# EAGLE design AM-24bit-ADS1231 (EAGLE 6.1)
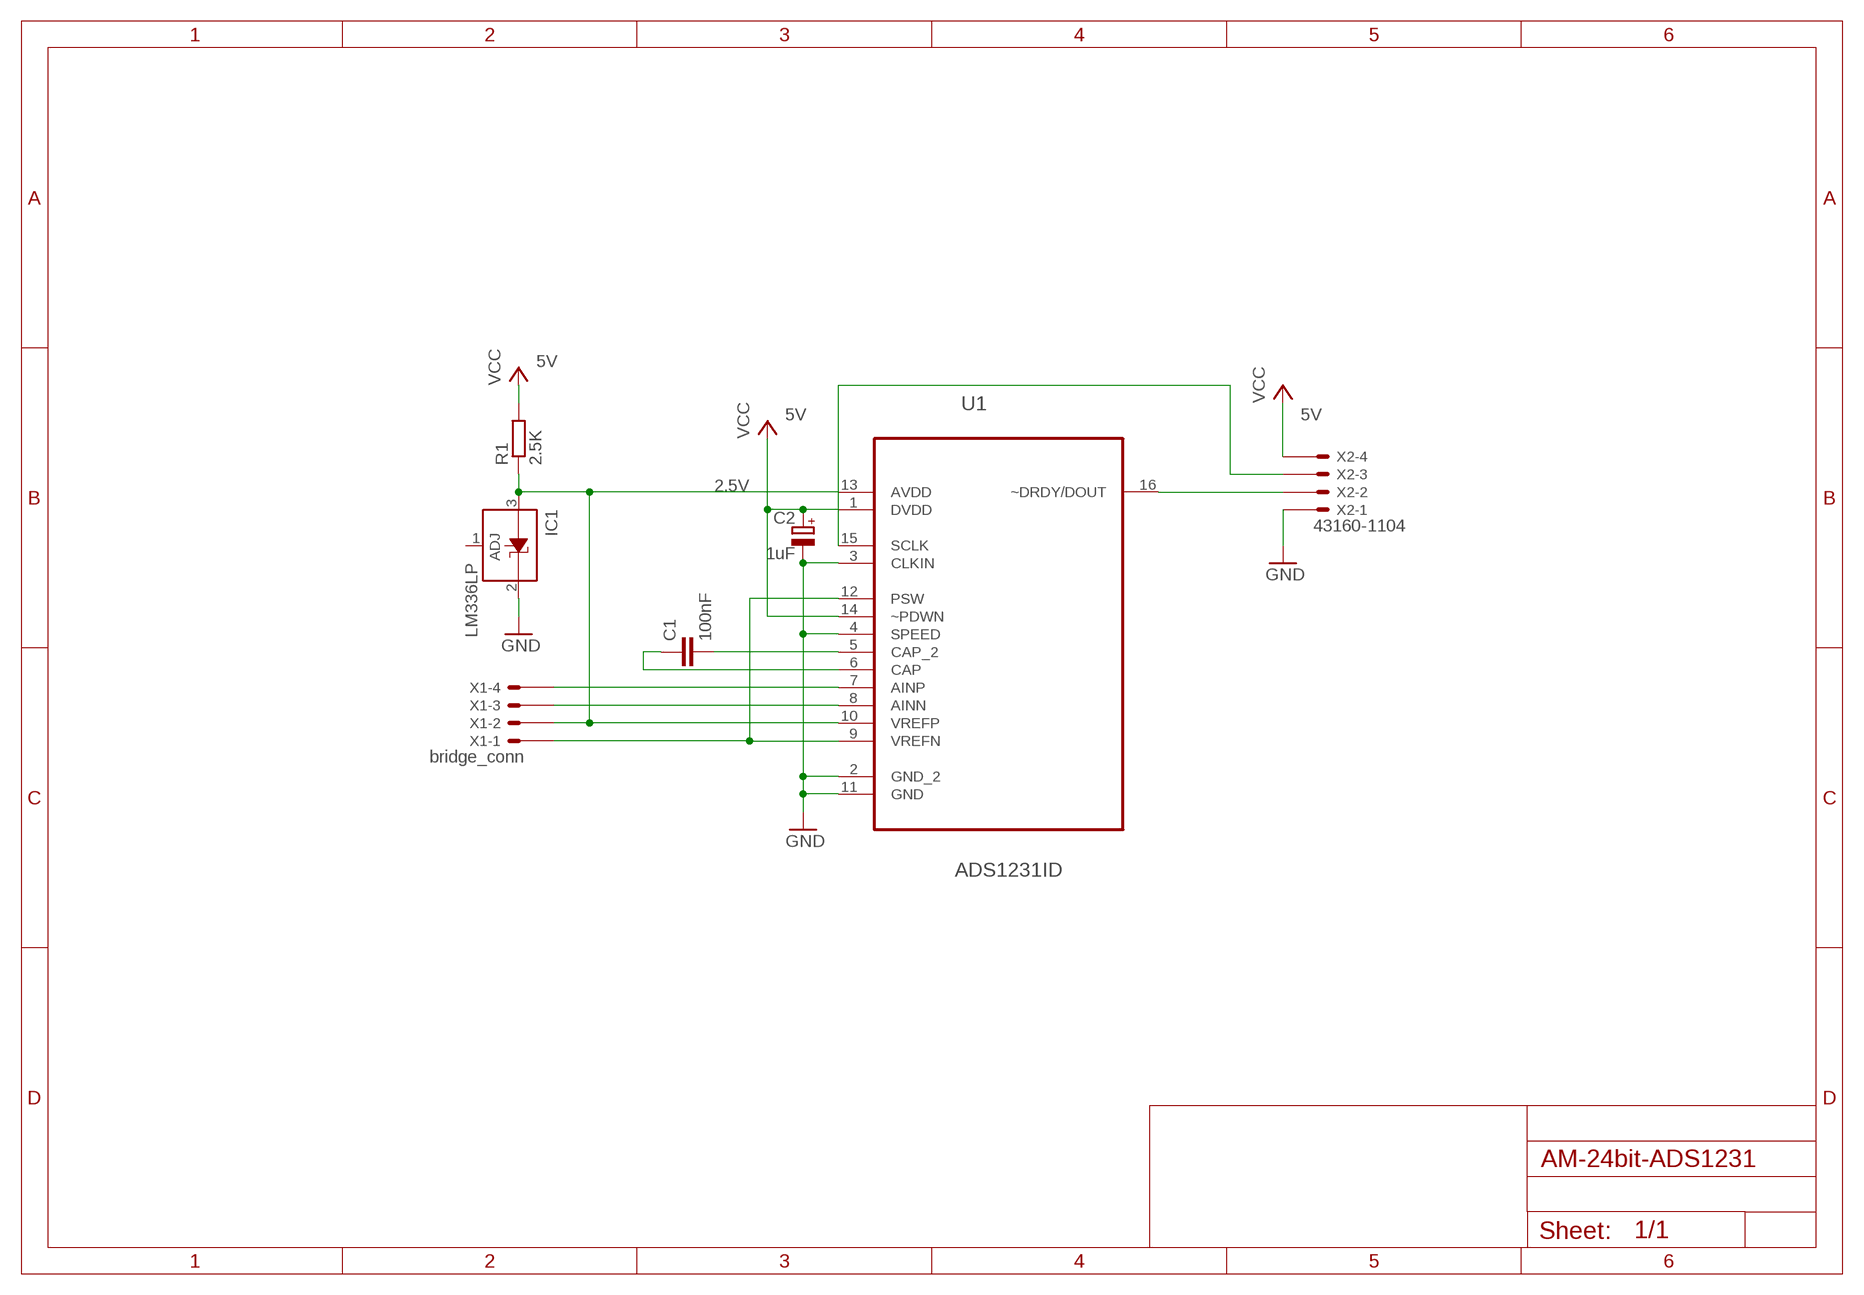
[diagram p0: schematic, sheet 1]

## Parts
C1  100nF  C-EUC1206K  [C1206K]
C2  1uF  CPOL-EU153CLV-0505  [153CLV-0505]
IC1  LM336LP  [TO92]
R1  2.5K  R-EU_R3225W  [R3225W]
U1  ADS1231ID  [SOIC127P600X175-16N]
X1  bridge_conn  43160-1104  [43160-XX04]
X2  43160-1104  [43160-XX04]

## Nets
2.5V: IC1.3(A) R1.1 U1.10(VREFP) U1.13(AVDD) X1.2@1(-2:S)
5V: C2.+ R1.2 U1.1(DVDD) U1.14(~PDWN) X2.4@1(-4:S) ; supply symbol labelled VCC
GND: C2.- IC1.2(C) U1.2(GND_2) U1.3(CLKIN) U1.4(SPEED) U1.11(GND) X2.1@1(-1:S)
N$1: C1.2 U1.5(CAP_2)
N$2: C1.1 U1.6(CAP)
N$3: U1.9(VREFN) U1.12(PSW) X1.1@1(-1:S)
N$4: U1.7(AINP) X1.4@1(-4:S)
N$5: U1.8(AINN) X1.3@1(-3:S)
N$7: U1.15(SCLK) X2.3@1(-3:S)
N$8: U1.16(~DRDY/DOUT) X2.2@1(-2:S)
Unconnected: IC1.1(ADJ) X1.1@2(-1:S) X1.2@2(-2:S) X1.3@2(-3:S) X1.4@2(-4:S) X2.1@2(-1:S) X2.2@2(-2:S) X2.3@2(-3:S) X2.4@2(-4:S)

## Library data of the parts
C1 = rcl:C-EU: CAPACITOR, European symbol
C2 = rcl:CPOL-EU: POLARIZED CAPACITOR, European symbol
IC1 = linear:LM336: 2.5-V INTEGRATED REFERENCE CIRCUITS LM236 Source: http://focus.ti.com/lit/ds/symlink/lm336-2.5.pdf
R1 = resistor:R-EU_: RESISTOR, European symbol
U1 = ADS1231:ADS1231ID: ADC; MPN: ADS1231ID; OC_FARNELL: 1882261; OC_NEWARK: 27T6158; PACKAGE: SOIC-16; SUPPLIER: Texas Instruments
X1 X2 = con-molex:43160-*04: SDA-43160 Connector Source: http://www.molex.com/pdm_docs/sd/431601306_sd.pdf; MF: WALDOM/MOLEX; MPN: 43160-1104; OC_FARNELL: unknown; OC_NEWARK: 54H0257

## Board
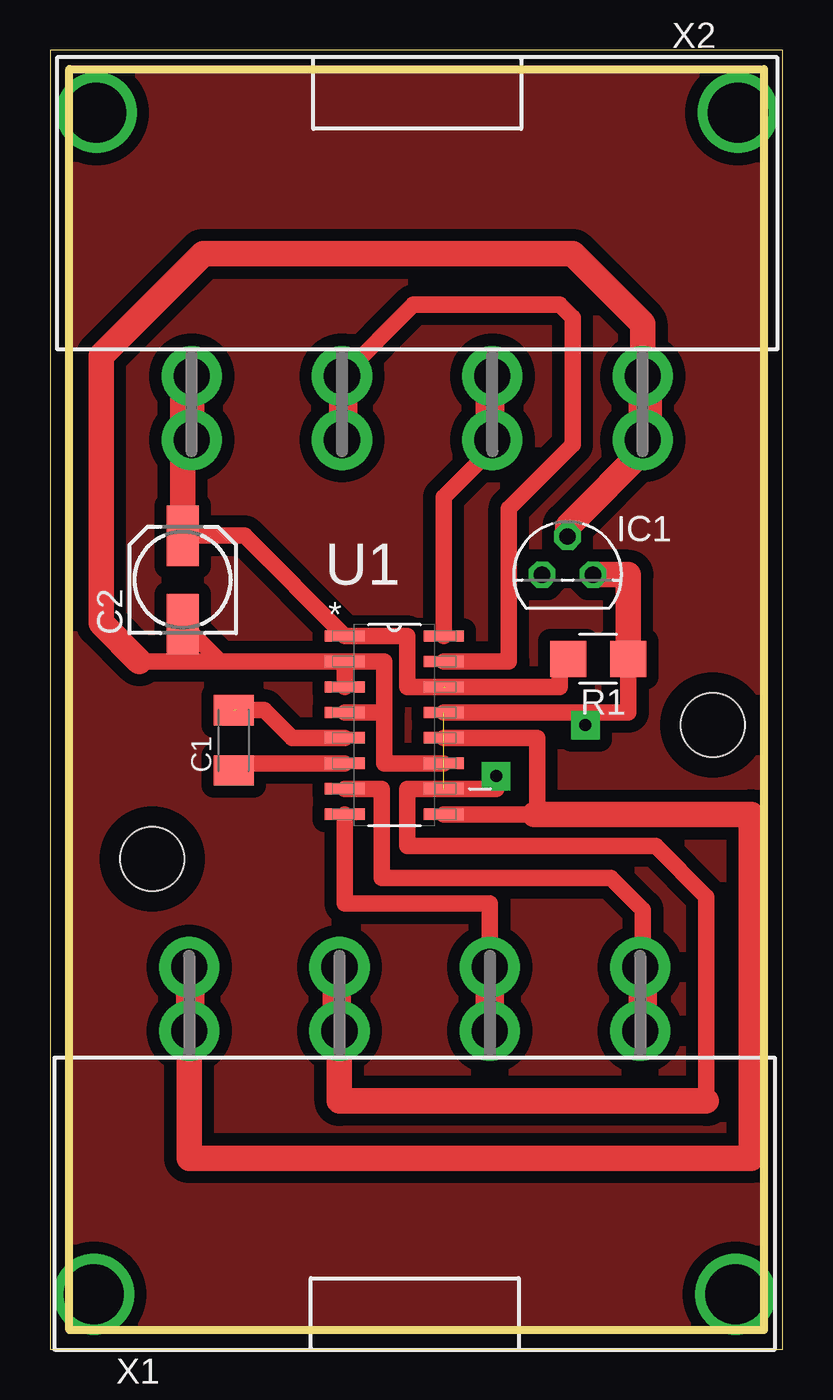
[diagram p1: board, top side]

Size 36.49 x 64.76 mm. Coordinates in mm from the lower left corner, seen from the top.
Outline: 0,0 36.49,0 36.49,64.76 0,64.76 0,0
Copper layers (1*16): Top 0.035mm / dielectric 1.5mm / Bottom 0.035mm
Design rules: minimum track width 10mil, minimum drill 24mil, track to track 8mil, track to pad 8mil, pad to pad 8mil, via to via 8mil, smd to smd 8mil, copper to edge 40mil, drill to drill 8mil, minimum pad ring 10mil, minimum via ring 8mil, stop-mask expansion 4mil, vias tented up to drill 0mil, thermal gap 10mil
Holes 3.2 mm at 5.08,24.45 33.02,31.11
Milling: 4 lines

### Footprints (pad centres in the part's own frame; a part is rotated, then mirrored left to right if it is on the bottom)
C1206K = smd 1.5 x 2: 1 -1.5,0; 2 1.5,0
153CLV-0505 = smd 3 x 1.6: + 2.2,0; - -2.2,0
TO92 = drill 0.813 octagon: 1 -1.27,0; 2 0,1.905; 3 1.27,0
R3225W = smd 1.8 x 1.8: 1 -1.499,0; 2 1.499,0
SOIC127P600X175-16N = smd 1.981 x 0.559: 1 -2.464,4.445; 2 -2.464,3.175; 3 -2.464,1.905; 4 -2.464,0.635; 5 -2.464,-0.635; 6 -2.464,-1.905; 7 -2.464,-3.175; 8 -2.464,-4.445; 9 2.464,-4.445; 10 2.464,-3.175; 11 2.464,-1.905; 12 2.464,-0.635; 13 2.464,0.635; 14 2.464,1.905; 15 2.464,3.175; 16 2.464,4.445
43160-XX04 = drill 1.8 pad 3: 1@1 -11.235,0; 1@2 -11.235,3.18; 2@1 -3.745,0; 2@2 -3.745,3.18; 3@1 3.745,0; 3@2 3.745,3.18; 4@1 11.235,0; 4@2 11.235,3.18 | drill 3 pad 3.4: M1 -15.985,-13.13; M2 15.985,-13.13

### Placement (x,y rotation side)
C1  9.14,30.35 90 top
C2  6.6,38.35 90 top
IC1  25.78,38.61 0 top
R1  27.3,34.42 180 top
U1  17.14,31.11 0 top
X1  18.16,15.88 0 top
X2  18.29,48.51 180 top

### Tracks (layer width: path | path; a pad name or v marks a point on that pad's centre or on a via)
2.5V  (1 unrouted)
  Top 0.813: R1.1 28.8,31.75 U1.13 26.67,31.75 26.67,31.11 | 32.7,12.38 32.7,22.54 30.16,25.08 17.78,25.08 17.78,27.94 U1.10 22.23,27.94 22.23,28.57
  Top 1.27: R1.1 28.8,38.61 IC1.3 | 32.7,12.38 14.42,12.38 X1.2@1
5V  (1 unrouted)
  Top 0.813: U1.14 17.78,33.02 17.78,35.56 U1.1 9.69,40.55 C2.+ | R1.2 25.4,34.42 25.4,33.02 19.68,33.02
  Top 1.27: C2.+ 6.6,48.06 X2.4@1
GND
  Top 0.813: U1.2 16.64,34.29 16.64,31.75 | 16.64,31.75 U1.4 | U1.11 16.64,29.21 16.64,31.75 | U1.3 U1.2 | U1.2 8.47,34.29 C2.- | U1.2 4.45,34.29
  Top 1.27: IC1.2 25.78,41.02 29.84,45.09 29.84,48.19 X2.1@1 29.52,51.12 26.04,54.61 7.62,54.61 2.54,49.53 2.54,36.2 4.45,34.29
N$1  (1 unrouted)
  Top 0.813: U1.5 12.06,30.48 10.67,31.88 9.27,31.88
N$2
  Top 0.813: U1.6 9.5,29.21 C1.1
N$3
  Top 0.813: U1.12 24.26,30.48 24.26,26.67 24.13,26.67 U1.9
  Top 1.27: 24.13,26.67 34.92,26.67 34.92,9.53 6.93,9.53 X1.1@1
N$4
  Top 0.813: U1.7 16.51,27.94 16.51,23.5 27.94,23.5 29.53,21.91 29.53,19.37 29.53,16.01 X1.4@1
  Top 1.422: 29.53,19.37 29.53,15.56
N$5
  Top 0.813: U1.8 14.68,22.23 21.91,22.23 21.91,19.37 X1.3@1
  Top 1.422: 21.91,19.37 21.91,15.56
N$6  (via drill 0.6 pad 1.42)
  other vias: 22.23,28.57
N$7
  Top 0.813: U1.15 22.86,34.29 22.86,41.91 26.04,45.09 26.04,51.44 25.4,52.07 18.1,52.07 X2.3@1
N$8
  Top 0.813: U1.16 19.61,42.47 22.23,45.09 22.23,48.32 X2.2@1
N$9  (via drill 0.6 pad 1.42)
  other vias: 26.67,31.11
N$10
  pour Top (isolate 0.61): 0.64,64.14 35.88,64.14 35.88,0.32 0.64,0.32
N$11
  Top 1.422: 6.99,19.37 6.99,15.56
N$12
  Top 1.422: 14.61,19.68 14.29,19.68 14.29,15.56
N$13
  Top 1.422: 6.99,48.58 6.99,45.4
N$14
  Top 1.422: 14.61,48.58 14.61,45.09
N$15
  Top 1.422: 21.91,48.26 21.91,45.09
N$16
  Top 1.422: 29.53,48.58 29.53,45.4